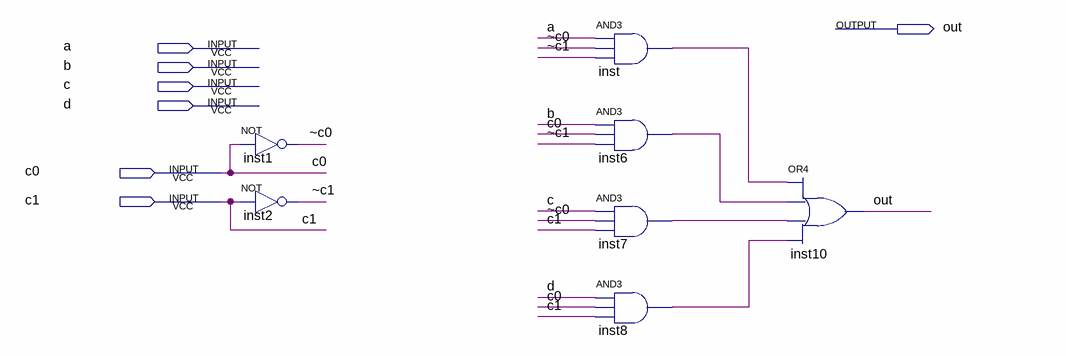
[diagram p0: schematic sheet]
// Quartus schematic MUX4x1_1.bdf as structural Verilog: 7 symbols, 7 pins
module MUX4x1_1 (
  input  a,
  input  b,
  input  c,
  input  d,
  input  c0,
  input  c1,
  output out
);

  wire inst6_out, inst7_out, inst8_out, inst_out, \~c0 , \~c1 ;

  not inst1 (\~c0 , c0);
  not inst2 (\~c1 , c1);
  and inst (inst_out, a, \~c0 , \~c1 );
  and inst6 (inst6_out, b, c0, \~c1 );
  and inst7 (inst7_out, c, \~c0 , c1);
  and inst8 (inst8_out, d, c0, c1);
  or inst10 (out, inst_out, inst6_out, inst7_out, inst8_out);
endmodule
